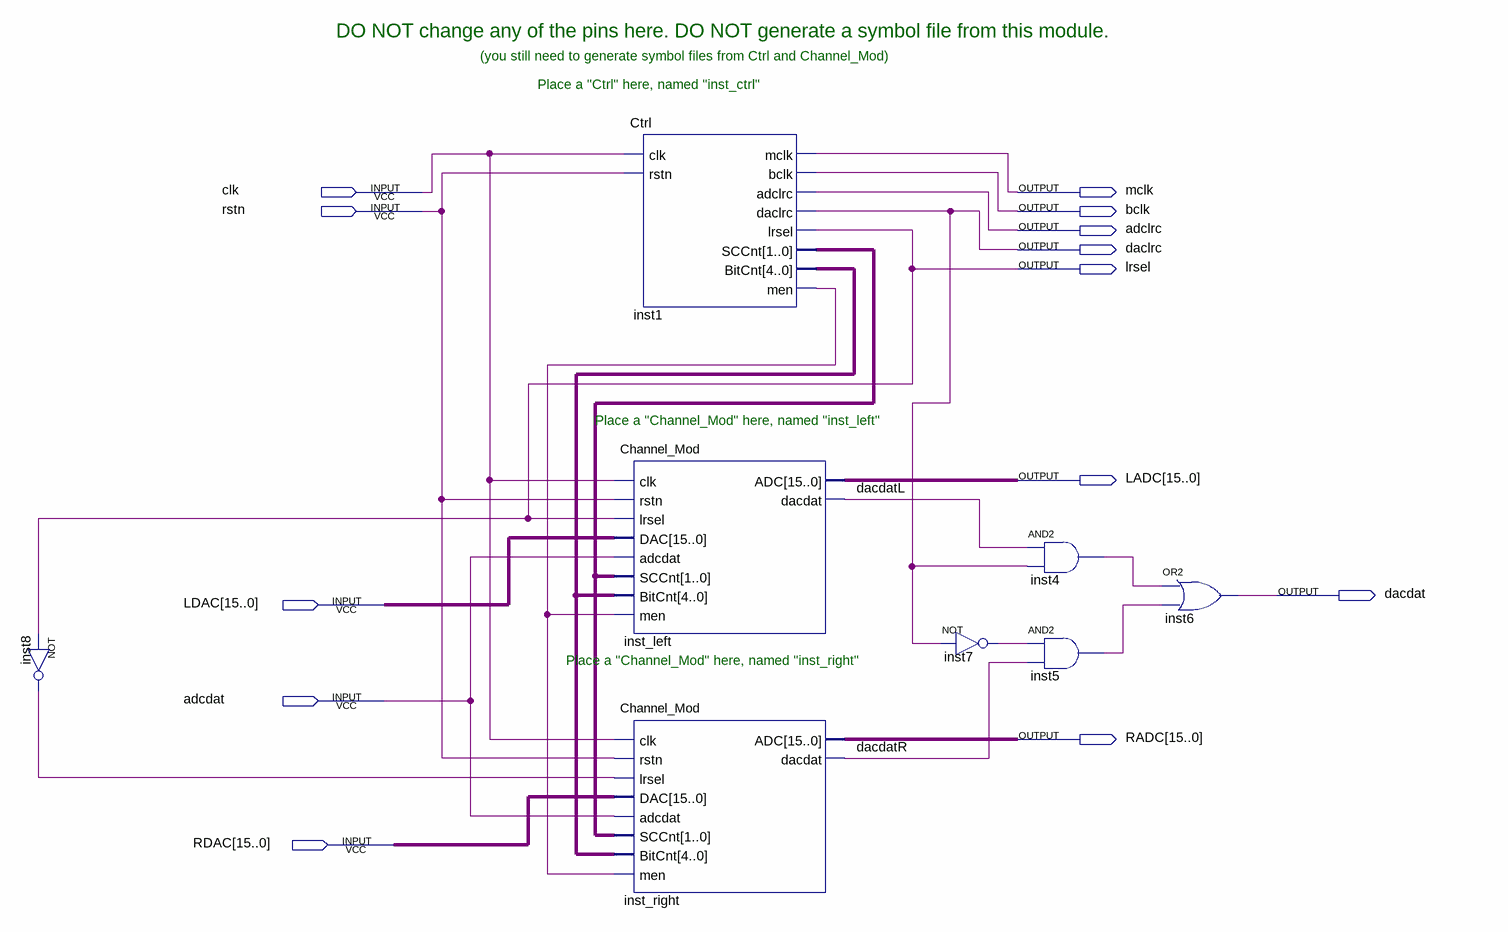
[diagram p0: schematic sheet]
// Quartus schematic SndDriver.bdf as structural Verilog: 8 symbols, 13 pins
module SndDriver (
  input  clk,
  input  rstn,
  input  [15:0] LDAC,
  input  adcdat,
  input  [15:0] RDAC,
  output mclk,
  output bclk,
  output adclrc,
  output daclrc,
  output lrsel,
  output [15:0] LADC,
  output dacdat,
  output [15:0] RADC
);

  wire dacdatL, dacdatR, inst1_men, inst4_out, inst5_out, inst7_out, inst8_out;
  wire [1:0] inst1_sccnt;
  wire [4:0] inst1_bitcnt;

  not inst8 (inst8_out, lrsel);
  Ctrl inst1 (
    .clk(clk), .rstn(rstn), .mclk(mclk), .bclk(bclk), .adclrc(adclrc), .daclrc(daclrc), .lrsel(lrsel),
    .SCCnt(inst1_sccnt), .BitCnt(inst1_bitcnt), .men(inst1_men));
  Channel_Mod inst_left (
    .clk(clk), .rstn(rstn), .lrsel(lrsel), .DAC(LDAC), .adcdat(adcdat), .SCCnt(inst1_sccnt),
    .BitCnt(inst1_bitcnt), .men(inst1_men), .ADC(LADC), .dacdat(dacdatL));
  Channel_Mod inst_right (
    .clk(clk), .rstn(rstn), .lrsel(inst8_out), .DAC(RDAC), .adcdat(adcdat), .SCCnt(inst1_sccnt),
    .BitCnt(inst1_bitcnt), .men(inst1_men), .ADC(RADC), .dacdat(dacdatR));
  not inst7 (inst7_out, daclrc);
  and inst4 (inst4_out, dacdatL, daclrc);
  and inst5 (inst5_out, inst7_out, dacdatR);
  or inst6 (dacdat, inst4_out, inst5_out);

  // Notes on the sheet:
  //   DO NOT change any of the pins here. DO NOT generate a symbol file from this module.
  //   (you still need to generate symbol files from Ctrl and Channel_Mod)
  //   Place a "Ctrl" here, named "inst_ctrl"
  //   Place a "Channel_Mod" here, named "inst_left"
  //   Place a "Channel_Mod" here, named "inst_right"
endmodule
